# EAGLE design ATmega328P_MCU (EAGLE 9.5.1)
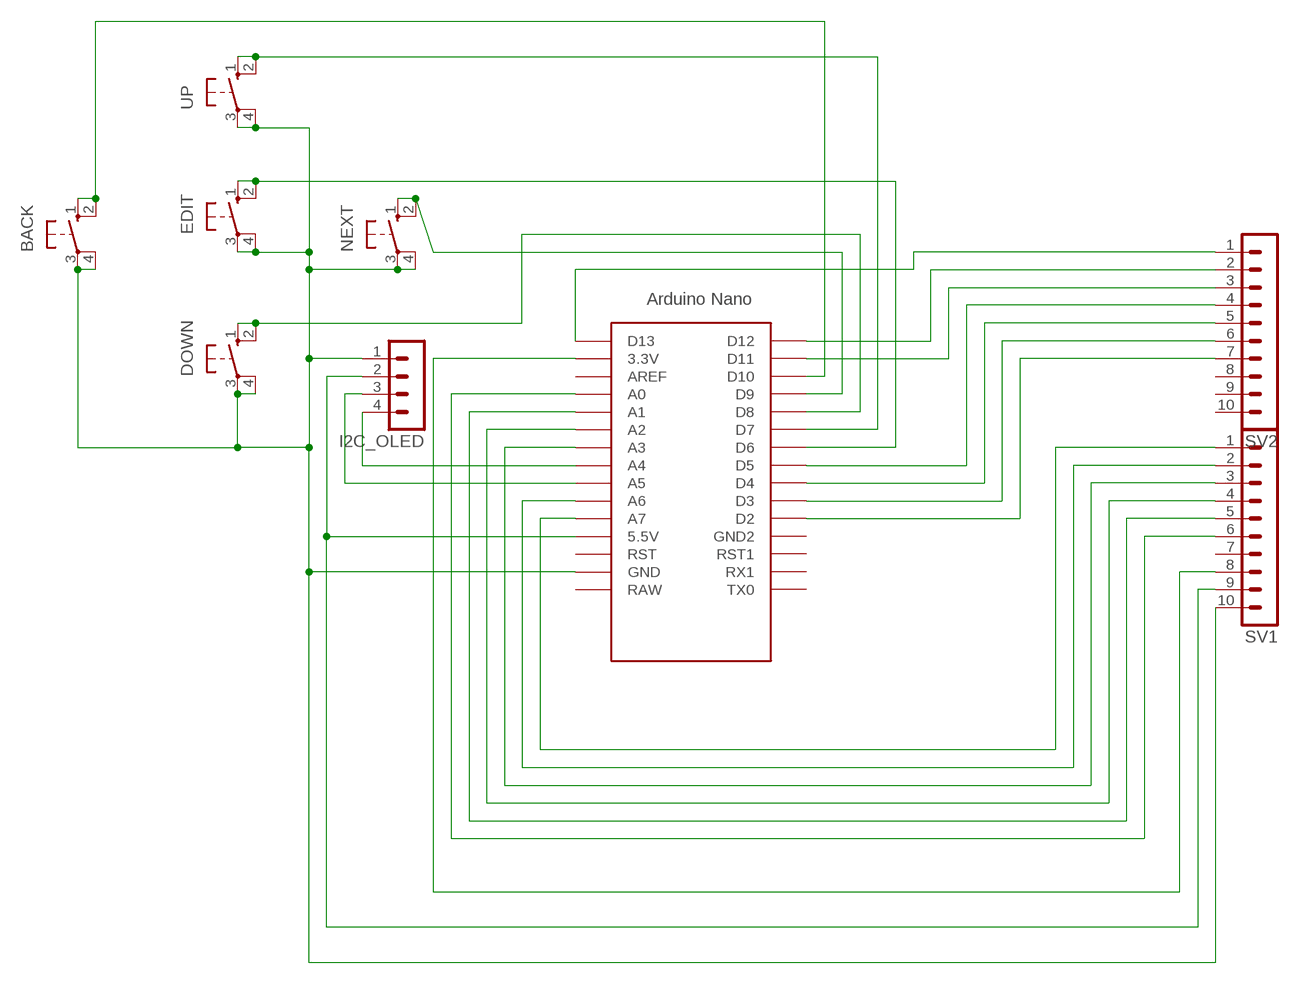
[diagram p0: schematic, sheet 1]

## Parts
ARDUINO  NANO  [NANO]
BACK  10-XX  [B3F-10XX]
DOWN  10-XX  [B3F-10XX]
EDIT  10-XX  [B3F-10XX]
I2C_OLED  MA04-1  [MA04-1]
NEXT  10-XX  [B3F-10XX]
SV1  MA10-1  [MA10-1]
SV2  MA10-1  [MA10-1]
UP  10-XX  [B3F-10XX]

## Nets
N$1: ARDUINO.D8 DOWN.1(S) DOWN.2(S1)
N$2: ARDUINO.5V(5.5V) I2C_OLED.2 SV1.9
N$3: ARDUINO.A4 I2C_OLED.4
N$4: ARDUINO.A5 I2C_OLED.3
N$5: ARDUINO.D5 SV2.4
N$6: ARDUINO.D9 NEXT.1(S) NEXT.2(S1)
N$7: ARDUINO.D7 UP.1(S) UP.2(S1)
N$8: ARDUINO.D10 BACK.1(S) BACK.2(S1)
N$9: ARDUINO.D6 EDIT.1(S) EDIT.2(S1)
N$10: ARDUINO.D4 SV2.5
N$11: ARDUINO.GND BACK.3(P) BACK.4(P1) DOWN.3(P) DOWN.4(P1) EDIT.3(P) EDIT.4(P1) I2C_OLED.1 NEXT.3(P) NEXT.4(P1) SV1.10 UP.3(P) UP.4(P1)
N$12: ARDUINO.D3 SV2.6
N$13: ARDUINO.D12 SV2.2
N$14: ARDUINO.D11 SV2.3
N$15: ARDUINO.3.3V SV1.8
N$17: ARDUINO.D13 SV2.1
N$18: ARDUINO.A0 SV1.6
N$19: ARDUINO.D2 SV2.7
N$20: ARDUINO.A1 SV1.5
N$21: ARDUINO.A2 SV1.4
N$22: ARDUINO.A3 SV1.3
N$23: ARDUINO.A6 SV1.2
N$24: ARDUINO.A7 SV1.1
Unconnected: ARDUINO.AREF ARDUINO.GND1(GND2) ARDUINO.RAW ARDUINO.RST ARDUINO.RST1 ARDUINO.RX1 ARDUINO.TX0 SV1.7 SV2.8 SV2.9 SV2.10

## Library data of the parts
ARDUINO = Arduino-clone:NANO: Arduino Nano
BACK DOWN EDIT NEXT UP = switch-omron:10-XX: OMRON SWITCH; MPN: B3F-1000; OC_FARNELL: 176432; OC_NEWARK: 36M3542
I2C_OLED = con-lstb:MA04-1: PIN HEADER; OC_FARNELL: unknown; OC_NEWARK: unknown
SV1 SV2 = con-lstb:MA10-1: PIN HEADER; OC_FARNELL: unknown; OC_NEWARK: unknown

## Board
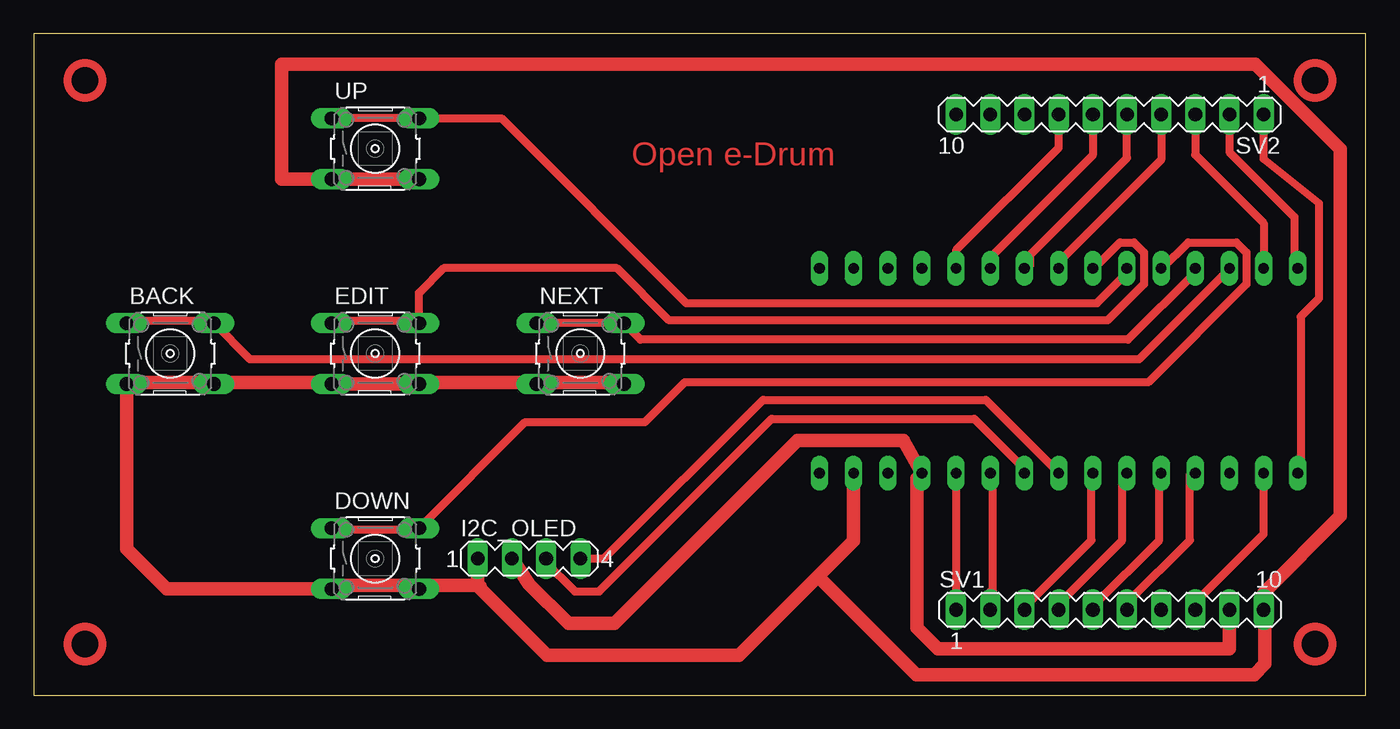
[diagram p1: board, top side]

Size 99.04 x 49.2 mm. Coordinates in mm from the lower left corner, seen from the top.
Outline: 0,0 99.04,0 99.04,49.2 0,49.2 0,0
Copper layers (1*16): Top 0.035mm / dielectric 1.5mm / Bottom 0.035mm
Design rules "default *": minimum track width 24mil, minimum drill 0.5mm, track to track 12mil, track to pad 12mil, pad to pad 12mil, via to via 12mil, smd to smd 12mil, copper to edge 40mil, drill to drill 6mil, minimum pad ring 10mil, minimum via ring 8mil, stop-mask expansion 4mil, vias tented up to drill 0mil, thermal gap 10mil

### Footprints (pad centres in the part's own frame; a part is rotated, then mirrored left to right if it is on the bottom)
NANO = drill 0.8 long: 3.3V -10.16,24.13; 5V -10.16,-1.27; A0 -10.16,19.05; A1 -10.16,16.51; A2 -10.16,13.97; A3 -10.16,11.43; A4 -10.16,8.89; A5 -10.16,6.35; A6 -10.16,3.81; A7 -10.16,1.27; AREF -10.16,21.59; D2 5.08,1.27; D3 5.08,3.81; D4 5.08,6.35; D5 5.08,8.89; D6 5.08,11.43; D7 5.08,13.97; D8 5.08,16.51; D9 5.08,19.05; D10 5.08,21.59; D11 5.08,24.13; D12 5.08,26.67; D13 -10.16,26.67; GND -10.16,-6.35; GND1 5.08,-1.27; RAW -10.16,-8.89; RST -10.16,-3.81; RST1 5.08,-3.81; RX1 5.08,-6.35; TX0 5.08,-8.89
B3F-10XX = drill 1.016 long: 1 -3.251,2.261; 2 3.251,2.261; 3 -3.251,-2.261; 4 3.251,-2.261
MA04-1 = drill 1.016 long: 1 -3.81,0; 2 -1.27,0; 3 1.27,0; 4 3.81,0
MA10-1 = drill 1.016 long: 1 -11.43,0; 2 -8.89,0; 3 -6.35,0; 4 -3.81,0; 5 -1.27,0; 6 1.27,0; 7 3.81,0; 8 6.35,0; 9 8.89,0; 10 11.43,0

### Placement (x,y rotation side)
ARDUINO  67.31,26.67 90 bottom
BACK  10.16,25.4 0 top
DOWN  25.4,10.16 0 top
EDIT  25.4,25.4 0 top
I2C_OLED  36.83,10.16 0 top
NEXT  40.64,25.4 0 top
SV1  80.01,6.35 0 top
SV2  80.01,43.18 180 top
UP  25.4,40.64 0 top

### Tracks (layer width: path | path; a pad name or v marks a point on that pad's centre or on a via)
N$1
  Top 0.61: DOWN.1 22.45,12.29 28.4,12.29 DOWN.2 36.55,20.32 45.44,20.32 48.39,23.27 82.86,23.27 90.16,30.57 90.16,32.93 89.42,33.67 85.84,33.67 83.92,31.75 ARDUINO.D8
N$2
  Top 1.016: SV1.9 88.9,3.45 67.23,3.45 65.66,5.03 65.66,16.13 ARDUINO.5V 64.65,18.95 56.79,18.95 43.18,5.33 39.75,5.33 36.83,8.26 I2C_OLED.2
N$3
  Top 0.61: I2C_OLED.4 42.42,10.16 54.23,21.97 70.79,21.97 75.89,16.87 ARDUINO.A4
N$4
  Top 0.61: ARDUINO.A5 73.61,16.87 69.93,20.55 54.86,20.55 42.04,7.72 40.23,7.72 37.95,10.01 I2C_OLED.3
N$5
  Top 0.61: SV2.4 83.82,39.83 76.35,32.36 76.35,31.95 ARDUINO.D5
N$6
  Top 0.61: ARDUINO.D9 86.36,31.45 81.36,26.44 45.11,26.44 NEXT.2 NEXT.1
N$7
  Top 0.61: ARDUINO.D7 81.28,31.39 79.05,29.16 48.51,29.16 34.77,42.9 UP.2 28.4,42.93 22.45,42.93 UP.1
N$8
  Top 0.61: ARDUINO.D10 88.7,31.5 82.19,24.99 16.08,24.99 BACK.2 13.41,27.84 7.01,27.84 BACK.1
N$9
  Top 0.61: EDIT.1 22.45,27.84 28.4,27.84 EDIT.2 28.65,29.92 30.48,31.75 43.36,31.75 47.25,27.86 79.83,27.86 82.54,30.57 82.54,32.93 81.8,33.67 80.76,33.67 78.84,31.75 ARDUINO.D6
N$10
  Top 0.61: ARDUINO.D4 74.07,31.95 74.07,32.74 81.28,39.95 SV2.5
N$11
  Top 1.016: NEXT.4 43.76,23.27 37.52,23.27 NEXT.3 36.98,23.27 28.85,23.27 EDIT.4 EDIT.3 22.02,23.27 13.41,23.27 | 13.41,23.27 7.01,23.27 BACK.3 6.91,10.87 9.88,7.9 DOWN.3 22.45,8.18 28.4,8.18 DOWN.4 28.85,8.18 32.97,8.18 38.18,2.97 52.45,2.97 58.32,8.84 | 13.41,23.27 BACK.4 | UP.4 22.3,38.38 22.05,38.35 22.12,38.35 UP.3 18.44,38.38 18.44,46.94 90.83,46.94 97.16,40.62 97.16,13.34 91.44,7.62 SV1.10 91.54,6.25 91.54,2.34 90.73,1.52 65.63,1.52 58.32,8.84 | ARDUINO.GND 60.96,11.48 58.32,8.84 | I2C_OLED.1 33.02,8.26 33.17,8.1
N$12
  Top 0.61: SV2.6 78.74,40.16 71.32,32.74 71.32,31.95 ARDUINO.D3
N$13
  Top 0.61: SV2.2 88.9,40.39 93.73,35.56 93.73,31.95 ARDUINO.D12
N$14
  Top 0.61: ARDUINO.D11 91.44,35.1 86.36,40.18 SV2.3
N$15
  Top 0.61: ARDUINO.3.3V 91.44,11.99 86.36,6.91 SV1.8
N$17
  Top 0.61: ARDUINO.D13 94.18,16.87 94.18,28.14 95.56,29.52 95.56,36.59 91.44,39.88 SV2.1
N$18
  Top 0.61: SV1.6 81.28,6.86 85.95,11.53 85.95,16.41 ARDUINO.A0
N$19
  Top 0.61: ARDUINO.D2 68.58,33.1 76.17,40.69 76.2,40.7 SV2.7
N$20
  Top 0.61: SV1.5 78.74,6.6 83.67,11.53 83.67,16.41 ARDUINO.A1
N$21
  Top 0.61: SV1.4 76.2,6.81 80.92,11.53 80.92,16.41 ARDUINO.A2
N$22
  Top 0.61: SV1.3 73.66,6.55 78.64,11.53 78.64,16.41 ARDUINO.A3
N$23
  Top 0.61: ARDUINO.A6 71.32,16.41 71.32,7.72 71.12,7.69 SV1.2
N$24
  Top 0.61: ARDUINO.A7 SV1.1
(copper drawn outside any net)
  shapes: Top circle x4

### Text on the board
Top: Open e-Drum